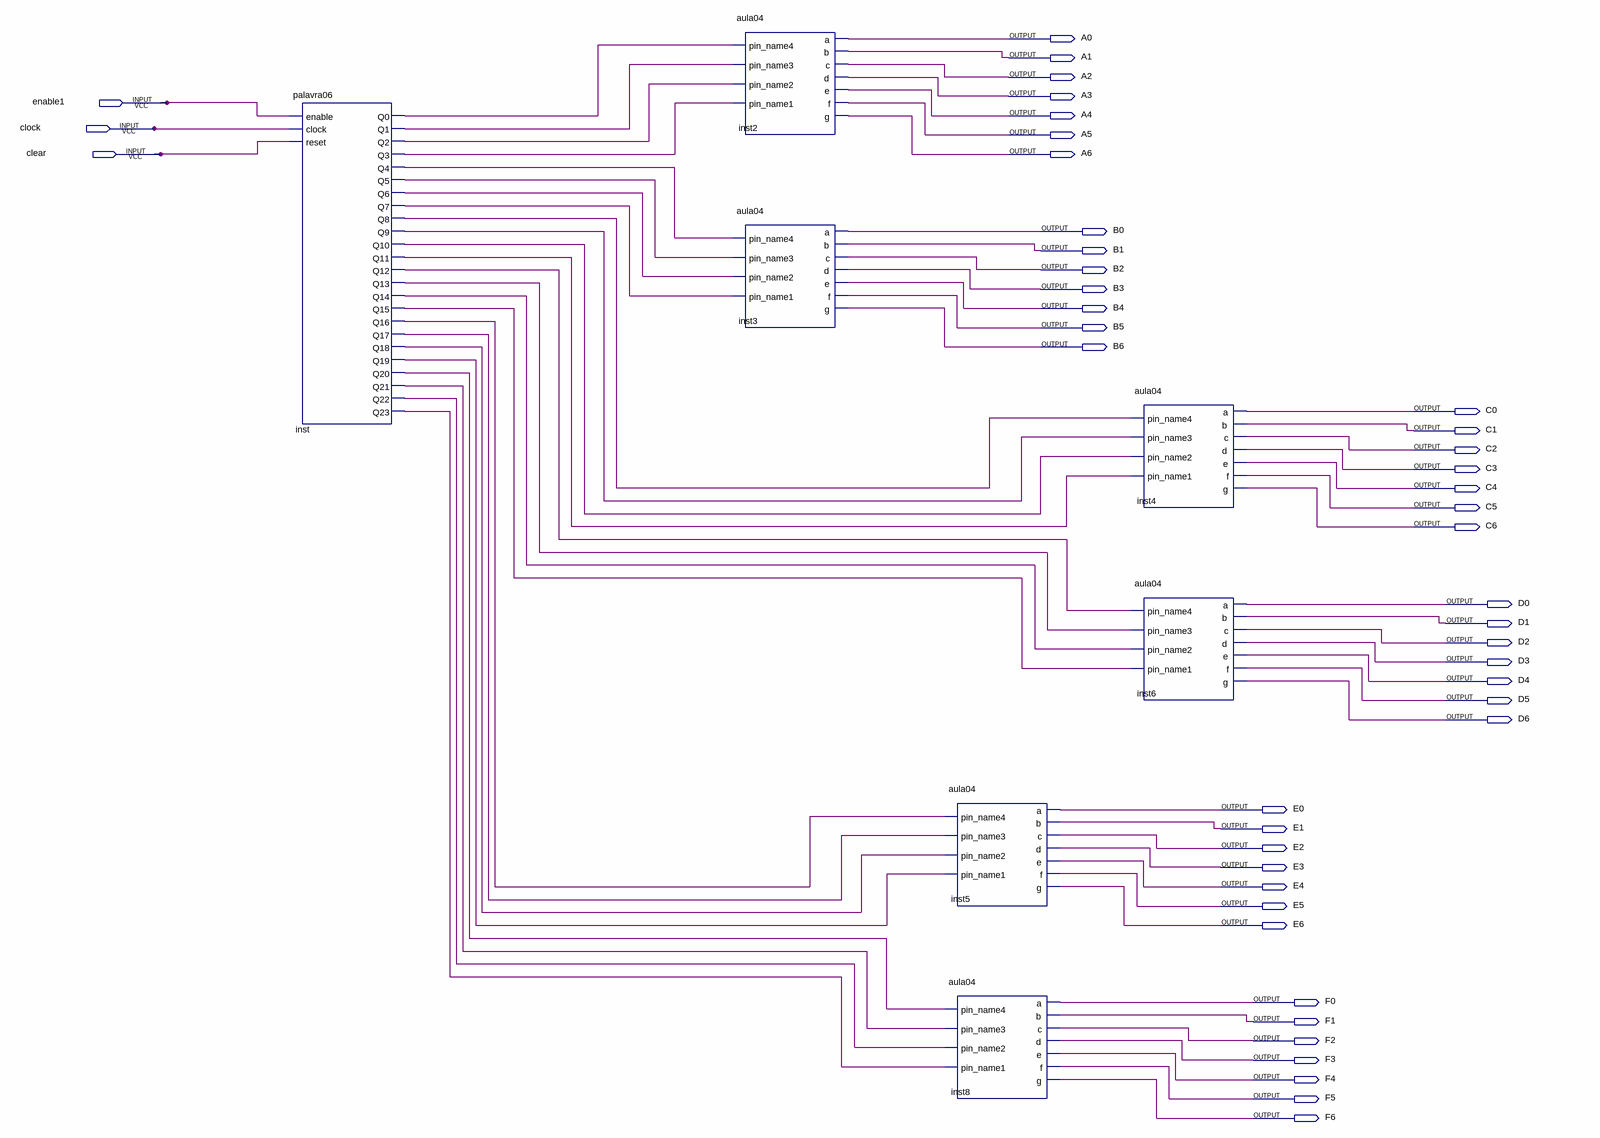
[diagram p0: schematic sheet]
// Quartus schematic parte5.bdf as structural Verilog: 7 symbols, 45 pins
module parte5 (
  input  enable1,
  input  clock,
  input  clear,
  output A0,
  output A1,
  output A2,
  output A3,
  output A4,
  output A5,
  output A6,
  output B0,
  output B1,
  output B2,
  output B3,
  output B4,
  output B5,
  output B6,
  output C0,
  output C1,
  output C2,
  output C3,
  output C4,
  output C5,
  output C6,
  output D0,
  output D1,
  output D2,
  output D3,
  output D4,
  output D5,
  output D6,
  output E0,
  output E1,
  output E2,
  output E3,
  output E4,
  output E5,
  output E6,
  output F0,
  output F1,
  output F2,
  output F3,
  output F4,
  output F5,
  output F6
);

  wire inst_q0, inst_q1, inst_q2, inst_q3, inst_q4, inst_q5, inst_q6, inst_q7, inst_q8, inst_q9, inst_q10,
       inst_q11, inst_q12, inst_q13, inst_q14, inst_q15, inst_q16, inst_q17, inst_q18, inst_q19, inst_q20,
       inst_q21, inst_q22, inst_q23;

  palavra06 inst (
    .enable(enable1), .clock(clock), .reset(clear), .Q0(inst_q0), .Q1(inst_q1), .Q2(inst_q2), .Q3(inst_q3),
    .Q4(inst_q4), .Q5(inst_q5), .Q6(inst_q6), .Q7(inst_q7), .Q8(inst_q8), .Q9(inst_q9), .Q10(inst_q10),
    .Q11(inst_q11), .Q12(inst_q12), .Q13(inst_q13), .Q14(inst_q14), .Q15(inst_q15), .Q16(inst_q16),
    .Q17(inst_q17), .Q18(inst_q18), .Q19(inst_q19), .Q20(inst_q20), .Q21(inst_q21), .Q22(inst_q22),
    .Q23(inst_q23));
  aula04 inst2 (
    .pin_name1(inst_q3), .pin_name4(inst_q0), .pin_name2(inst_q2), .pin_name3(inst_q1), .a(A0), .b(A1),
    .c(A2), .d(A3), .e(A4), .f(A5), .g(A6));
  aula04 inst3 (
    .pin_name1(inst_q7), .pin_name4(inst_q4), .pin_name2(inst_q6), .pin_name3(inst_q5), .a(B0), .b(B1),
    .c(B2), .d(B3), .e(B4), .f(B5), .g(B6));
  aula04 inst5 (
    .pin_name1(inst_q19), .pin_name4(inst_q16), .pin_name2(inst_q18), .pin_name3(inst_q17), .a(E0), .b(E1),
    .c(E2), .d(E3), .e(E4), .f(E5), .g(E6));
  aula04 inst8 (
    .pin_name1(inst_q23), .pin_name4(inst_q20), .pin_name2(inst_q22), .pin_name3(inst_q21), .a(F0), .b(F1),
    .c(F2), .d(F3), .e(F4), .f(F5), .g(F6));
  aula04 inst4 (
    .pin_name1(inst_q11), .pin_name4(inst_q8), .pin_name2(inst_q10), .pin_name3(inst_q9), .a(C0), .b(C1),
    .c(C2), .d(C3), .e(C4), .f(C5), .g(C6));
  aula04 inst6 (
    .pin_name1(inst_q15), .pin_name4(inst_q12), .pin_name2(inst_q14), .pin_name3(inst_q13), .a(D0), .b(D1),
    .c(D2), .d(D3), .e(D4), .f(D5), .g(D6));
endmodule
